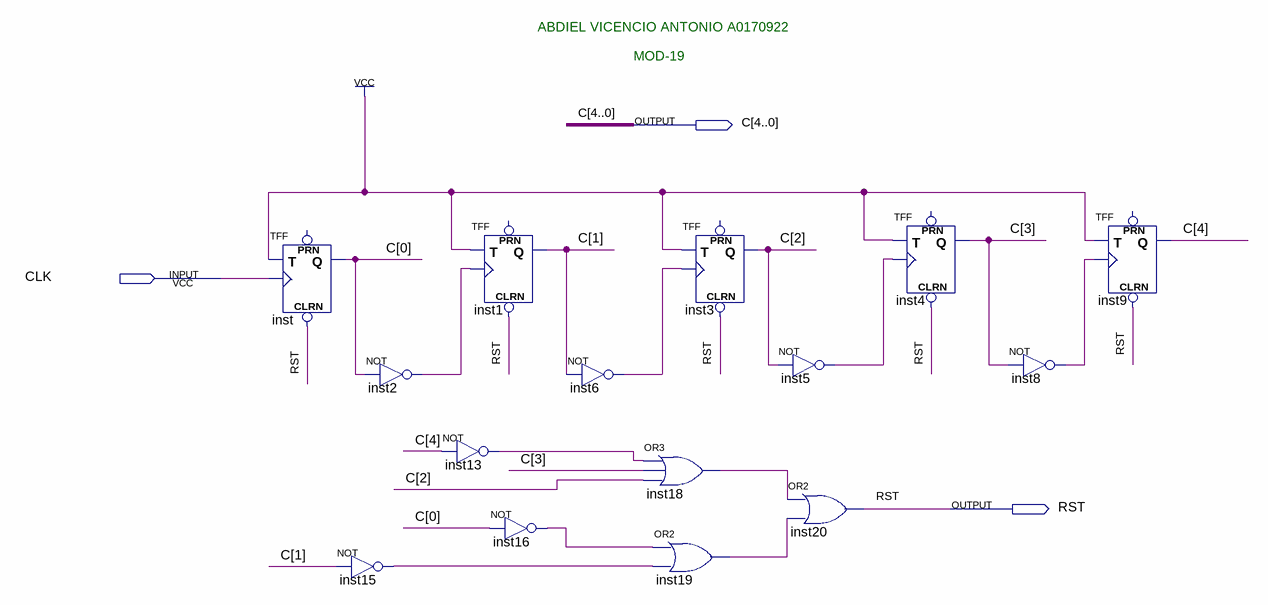
[diagram p0: schematic sheet]
// Quartus schematic ContadorMod19T.bdf as structural Verilog: 15 symbols, 3 pins
module ContadorMod19T (
  input  CLK,
  output [4:0] C,
  output RST
);

  wire inst2_out, inst5_out, inst6_out, inst8_out, inst13_out, inst15_out, inst16_out, inst18_out, inst19_out;

  TFF inst (.CLRN(RST), .T(1'b1), .CLK(CLK), .Q(C[0]));  // open: PRN
  not inst15 (inst15_out, C[1]);
  not inst2 (inst2_out, C[0]);
  TFF inst1 (.CLRN(RST), .T(1'b1), .CLK(inst2_out), .Q(C[1]));  // open: PRN
  not inst13 (inst13_out, C[4]);
  not inst16 (inst16_out, C[0]);
  not inst6 (inst6_out, C[1]);
  or inst18 (inst18_out, inst13_out, C[3], C[2]);
  or inst19 (inst19_out, inst16_out, inst15_out);
  TFF inst3 (.CLRN(RST), .T(1'b1), .CLK(inst6_out), .Q(C[2]));  // open: PRN
  not inst5 (inst5_out, C[2]);
  or inst20 (RST, inst18_out, inst19_out);
  TFF inst4 (.CLRN(RST), .T(1'b1), .CLK(inst5_out), .Q(C[3]));  // open: PRN
  not inst8 (inst8_out, C[3]);
  TFF inst9 (.CLRN(RST), .T(1'b1), .CLK(inst8_out), .Q(C[4]));  // open: PRN

  // Notes on the sheet:
  //   ABDIEL VICENCIO ANTONIO A0170922
  //   MOD-19
endmodule
